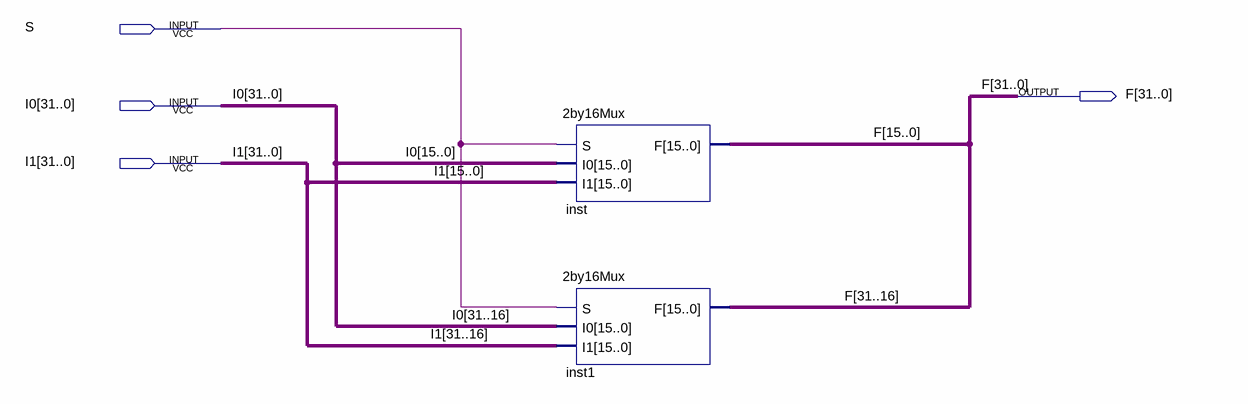
[diagram p0: schematic sheet]
// Quartus schematic 32bit2to1MUX.bdf as structural Verilog: 2 symbols, 4 pins
module \32bit2to1MUX  (
  input  S,
  input  [31:0] I0,
  input  [31:0] I1,
  output [31:0] F
);

  \2by16Mux  inst (.S(S), .I0(I0[15:0]), .I1(I1[15:0]), .F(F[15:0]));
  \2by16Mux  inst1 (.S(S), .I0(I0[31:16]), .I1(I1[31:16]), .F(F[31:16]));
endmodule
